# Altium schematic sheet POWER.SchDoc: Bison-Board
size A4; DrawnBy: mzy2364; Revision: V1.4
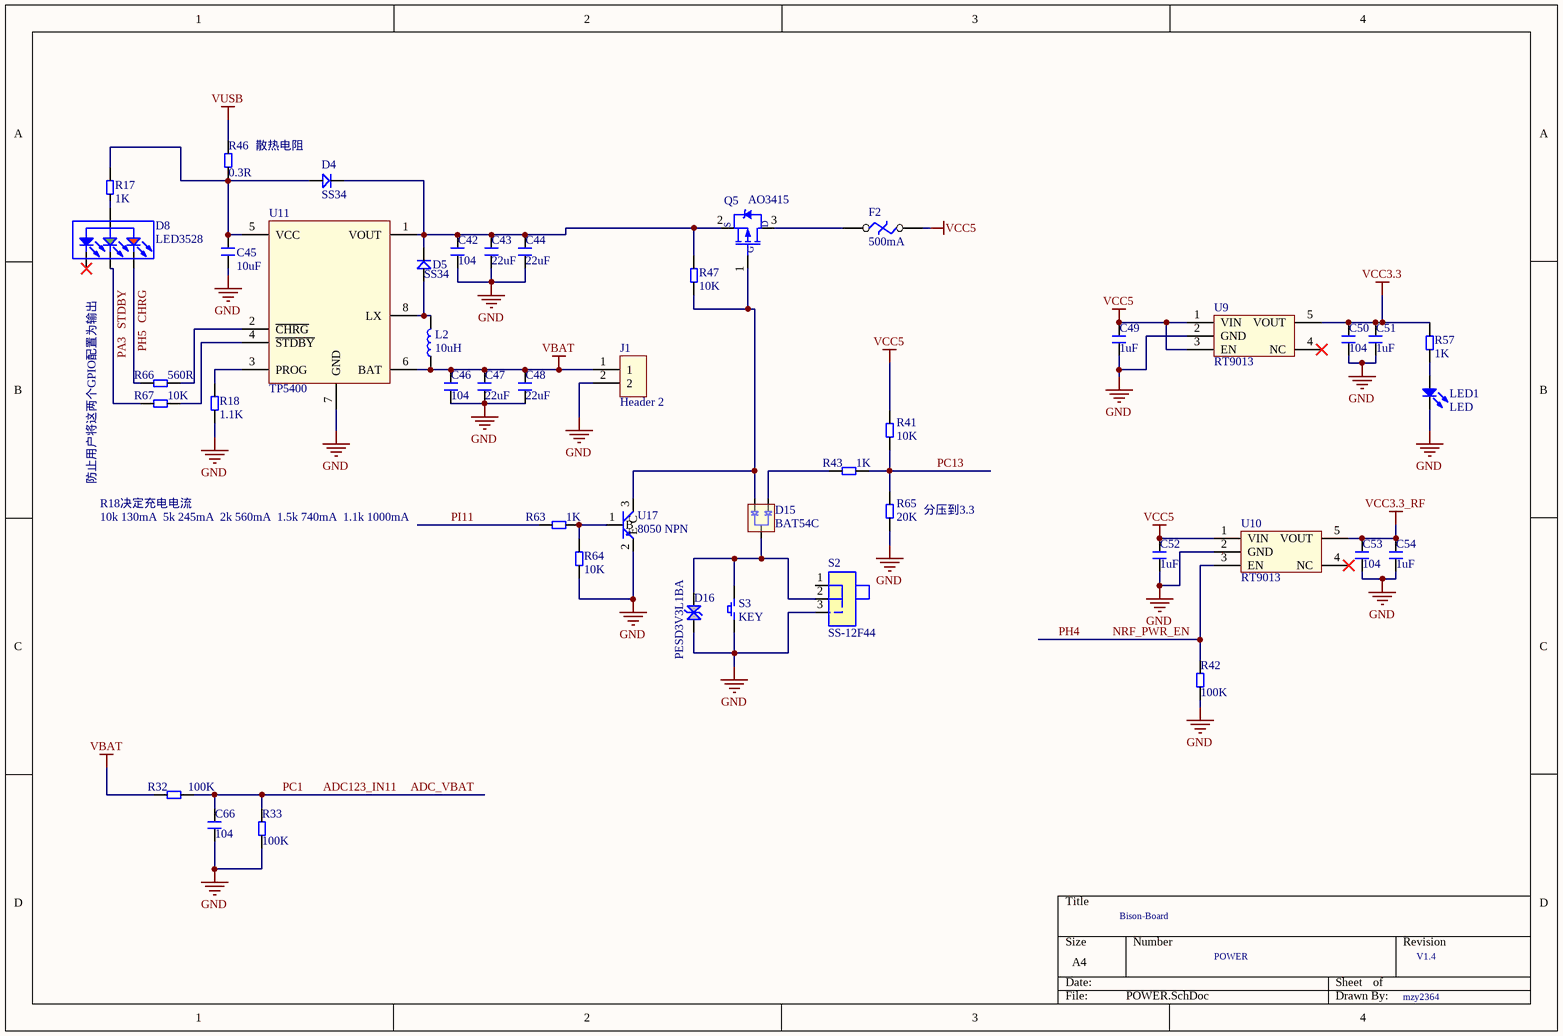
[diagram p0: POWER.SchDoc]

## Parts
C42  104  [C 0603]
C43  22uF  [C 0805]
C44  22uF  [C 0805]
C45  10uF  [C 0805]
C46  104  [C 0603]
C47  22uF  [C 0805]
C48  22uF  [C 0805]
C49  1uF  [C 0603]
C50  104  [C 0603]
C51  1uF  [C 0603]
C52  1uF  [C 0603]
C53  104  [C 0603]
C54  1uF  [C 0603]
C66  104  [C 0603]
D4  SS34  [SMA]
D5  SS34  [SMA]
D8  LED3528  [LED3528-4PIN]
D15  BAT54C  [SOT23-3]
D16  PESD3V3L1BA  [SOD323]
F2  500mA  [F 0805]
J1  Header 2  [XH2.54-WS-2P]
L2  10uH  [L_SMNR4030]
LED1  LED  [LED0603]
Q5  AO3415  [SOT23-3]
R17  1K  [R 0603]
R18  1.1K  [R 0603]
R32  100K  [R 0603]
R33  100K  [R 0603]
R41  10K  [R 0603]
R42  100K  [R 0603]
R43  1K  [R 0603]
R46  0.3R  [R 0805]
R47  10K  [R 0603]
R57  1K  [R 0603]
R63  1K  [R 0603]
R64  10K  [R 0603]
R65  20K  [R 0603]
R66  560R  [R 0603]
R67  10K  [R 0603]
S2  SS-12F44  [K3-1280S-L1]
S3  KEY  [KEY-TC-153]
U9  RT9013  [SOT23-5]
U10  RT9013  [SOT23-5]
U11  TP5400  [TP5410]
U17  8050 NPN  [SOT23-3]

## Nets
GND: C42.1 C43.1 C44.1 C45.1 C46.1 C47.1 C48.1 C49.1 C50.1 C51.1 C52.1 C53.1 C54.1 C66.1 D16.1 J1.2 LED1.2(K) R18.1 R33.2 R42.1 R64.2 R65.2 S2.3 S3.1 U9.2(GND) U10.2(GND) U11.7(GND) U17.2(E)
VBAT: C46.2 C47.2 C48.2 J1.1 L2.2 R32.2 U11.6(BAT)
VCC3.3: C50.2 C51.2 R57.2 U9.5(VOUT)
VCC3.3_RF: C53.2 C54.2 U10.5(VOUT)
VCC5: C49.2 C52.2 F2.1 R41.1 U9.1(VIN) U9.3(EN) U10.1(VIN)
VUSB: R46.2
ADC123_IN11: C66.2 R32.1 R33.1  [also labelled ADC_VBAT, PC1]
CHRG: D8.1(R) R66.2  [also labelled PH5]
NRF_PWR_EN: R42.2 U10.3(EN)  [also labelled PH4]
PA3: D8.4(G) R67.2  [also labelled STDBY]
PC13: R41.2 R43.1 R65.1
PI11: R63.2
NetC42_2: C42.2 C43.2 C44.2 D4.2 D5.2 Q5.2(S) R47.1 U11.1(VOUT)
NetC45_2: C45.2 D4.1 R17.2 R46.1 U11.5(VCC)
NetD5_1: D5.1 L2.1 U11.8(LX)
NetD8_2: D8.2(+) R17.1
NetD15_1: D15.1 R43.2
NetD15_2: D15.2 Q5.1(G) R47.2 U17.3(C)
NetD15_3: D15.3 D16.2 S2.2 S3.2
NetF2_2: F2.2 Q5.3(D)
NetLED1_1: LED1.1(A) R57.1
NetR18_2: R18.2 U11.3(PROG)
NetR63_1: R63.1 R64.1 U17.1(B)
NetR66_1: R66.1 U11.2(~{CHRG})
NetR67_1: R67.1 U11.4(~{STDBY})

Not connected (* = marked no-connect by the designer): D8 3(B)*; S2 1; U9 4(NC)*; U10 4(NC)*

## Notes on the sheet
- (near R46) 散热电阻
- 10k 130mA  5k 245mA  2k 560mA  1.5k 740mA  1.1k 1000mA
- 防止用户将这两个GPIO配置为输出
- R18决定充电电流
- (near R65) 分压到3.3
- POWER

## Library data of the parts
C42-C54 C66 = CAP
D4 D5 = Diode
D16 = D Schottky1: 双向TVS
F2 = F: 熔断开关
L2 = L
Q5 = PMOS-2
R17 R18 R32 R33 R41-R43 R46 R47 R57 R63-R67 = RES
S2 = SWITCH
U9 U10 = RT9013: 500mA低压差LDO
U11 = TP5410
U17 = NPN